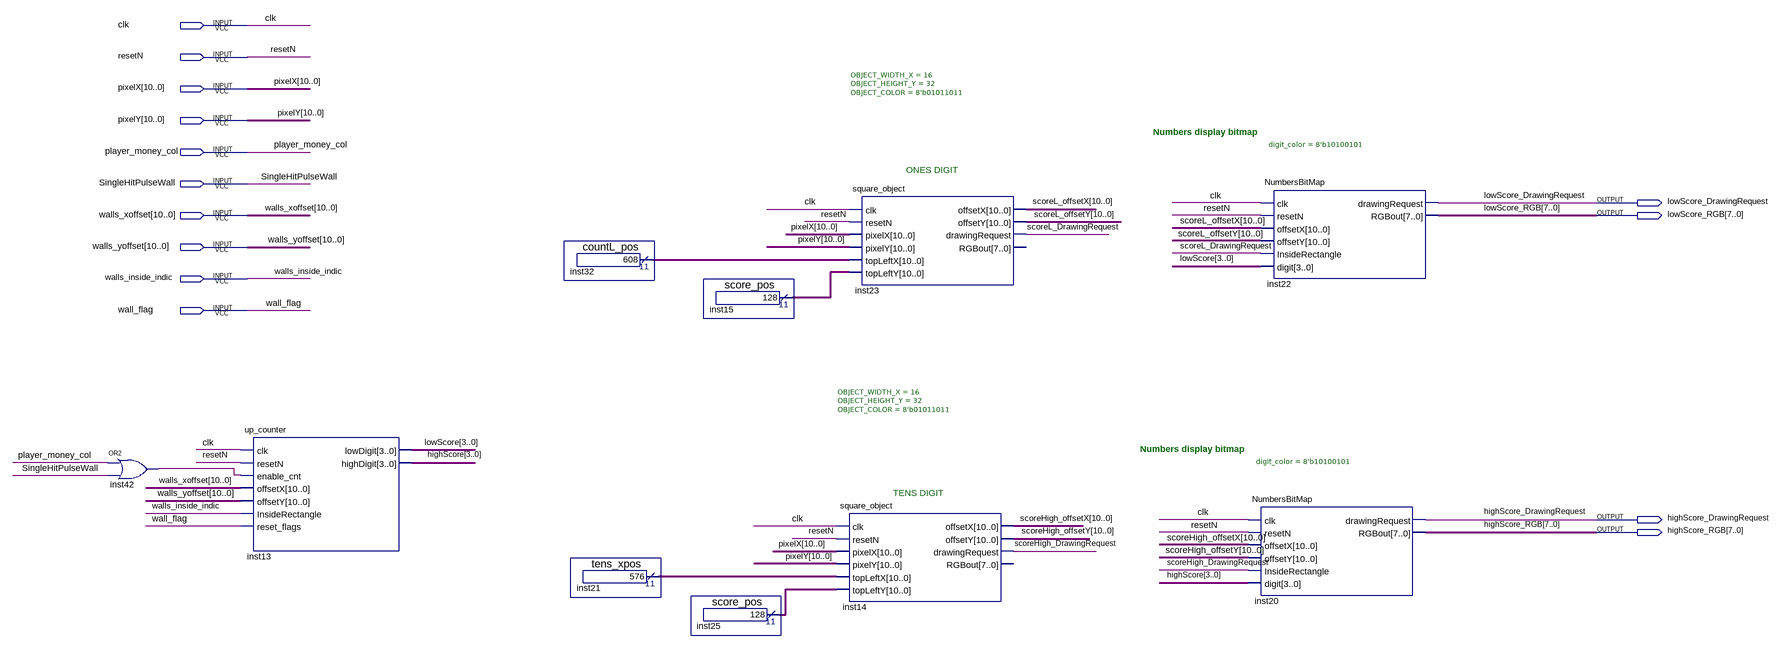
[diagram p0: schematic sheet]
// Quartus schematic SCORE_DISPLAY.bdf as structural Verilog: 10 symbols, 14 pins
module SCORE_DISPLAY (
  input  clk,
  input  resetN,
  input  [10:0] pixelX,
  input  [10:0] pixelY,
  input  player_money_col,
  input  SingleHitPulseWall,
  input  [10:0] walls_xoffset,
  input  [10:0] walls_yoffset,
  input  walls_inside_indic,
  input  wall_flag,
  output lowScore_DrawingRequest,
  output [7:0] lowScore_RGB,
  output highScore_DrawingRequest,
  output [7:0] highScore_RGB
);

  wire inst42_out, scoreHigh_DrawingRequest, scoreL_DrawingRequest;
  wire [3:0] highScore, lowScore;
  wire [10:0] inst15_result, inst21_result, inst25_result, inst32_result, scoreHigh_offsetX,
       scoreHigh_offsetY, scoreL_offsetX, scoreL_offsetY;

  or inst42 (inst42_out, player_money_col, SingleHitPulseWall);
  up_counter inst13 (
    .clk(clk), .resetN(resetN), .enable_cnt(inst42_out), .offsetX(walls_xoffset), .offsetY(walls_yoffset),
    .InsideRectangle(walls_inside_indic), .reset_flags(wall_flag), .lowDigit(lowScore), .highDigit(highScore));
  countL_pos inst32 (.result(inst32_result));
  tens_xpos inst21 (.result(inst21_result));
  score_pos inst15 (.result(inst15_result));
  score_pos inst25 (.result(inst25_result));
  square_object #(.OBJECT_WIDTH_X(16), .OBJECT_HEIGHT_Y(32), .OBJECT_COLOR(8'b01011011)) inst23 (
    .clk(clk), .resetN(resetN), .pixelX(pixelX), .pixelY(pixelY), .topLeftX(inst32_result),
    .topLeftY(inst15_result), .offsetX(scoreL_offsetX), .offsetY(scoreL_offsetY),
    .drawingRequest(scoreL_DrawingRequest));  // open: RGBout
  square_object #(.OBJECT_WIDTH_X(16), .OBJECT_HEIGHT_Y(32), .OBJECT_COLOR(8'b01011011)) inst14 (
    .clk(clk), .resetN(resetN), .pixelX(pixelX), .pixelY(pixelY), .topLeftX(inst21_result),
    .topLeftY(inst25_result), .offsetX(scoreHigh_offsetX), .offsetY(scoreHigh_offsetY),
    .drawingRequest(scoreHigh_DrawingRequest));  // open: RGBout
  NumbersBitMap #(.digit_color(8'b10100101)) inst22 (
    .clk(clk), .resetN(resetN), .offsetX(scoreL_offsetX), .offsetY(scoreL_offsetY),
    .InsideRectangle(scoreL_DrawingRequest), .digit(lowScore), .drawingRequest(lowScore_DrawingRequest),
    .RGBout(lowScore_RGB));
  NumbersBitMap #(.digit_color(8'b10100101)) inst20 (
    .clk(clk), .resetN(resetN), .offsetX(scoreHigh_offsetX), .offsetY(scoreHigh_offsetY),
    .InsideRectangle(scoreHigh_DrawingRequest), .digit(highScore), .drawingRequest(highScore_DrawingRequest),
    .RGBout(highScore_RGB));

  // Notes on the sheet:
  //   Numbers display bitmap
  //   ONES DIGIT
  //   Numbers display bitmap
  //   TENS DIGIT
endmodule
